# Altium schematic sheet Switches.SchDoc
size A4
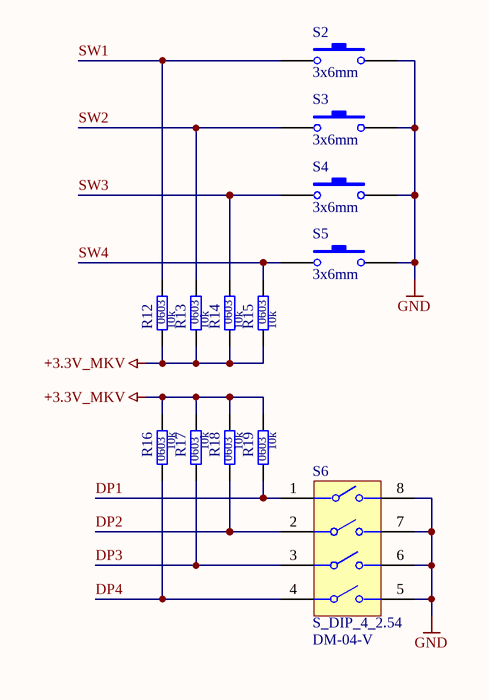
[diagram p0: Switches.SchDoc]

## Parts
R12  value 10k  SCH_Footprint: 0603  [R_0603_1608]  (hidden comment: Resistor)
R13  value 10k  SCH_Footprint: 0603  [R_0603_1608]  (hidden comment: Resistor)
R14  value 10k  SCH_Footprint: 0603  [R_0603_1608]  (hidden comment: Resistor)
R15  value 10k  SCH_Footprint: 0603  [R_0603_1608]  (hidden comment: Resistor)
R16  value 10k  SCH_Footprint: 0603  [R_0603_1608]  (hidden comment: Resistor)
R17  value 10k  SCH_Footprint: 0603  [R_0603_1608]  (hidden comment: Resistor)
R18  value 10k  SCH_Footprint: 0603  [R_0603_1608]  (hidden comment: Resistor)
R19  value 10k  SCH_Footprint: 0603  [R_0603_1608]  (hidden comment: Resistor)
S2  3x6mm  [S_TACTSWITCH3x6]
S3  3x6mm  [S_TACTSWITCH3x6]
S4  3x6mm  [S_TACTSWITCH3x6]
S5  3x6mm  [S_TACTSWITCH3x6]
S6  value DM-04-V  [S_DIP_4_2.54]  (hidden comment: DIP SWITCH 4 POS)

## Nets
+3.3V_MKV: R12.1 R13.1 R14.1 R15.1 R16.1 R17.1 R18.1 R19.1
GND: S2.2 S3.2 S4.2 S5.2 S6.5 S6.6 S6.7 S6.8
DP1: R19.2 S6.1
DP2: R18.2 S6.2
DP3: R17.2 S6.3
DP4: R16.2 S6.4
SW1: R12.2 S2.1
SW2: R13.2 S3.1
SW3: R14.2 S4.1
SW4: R15.2 S5.1

## Library data of the parts
R12-R19 = R_10k_0603_1: Manufacturer: Vishay; Manufacturer Part Number: CRCW060310K0FKTABC; Voltage: 75V; Power: 100mW; Tolerance: 1%; Part Number: R_10k_0603_1; HelpURL: http://www.tme.eu/pl/Document/622e28308c06d160637f2b14751ba16b/Data%20Sheet%20CRCW_BCe3.pdf; Supplier 1: TME; Supplier Part Number 1: CRCW060310K0FKTABC; Supplier 2: RS Components; Supplier 3: Farnell; Supplier 4: Mouser; Supplier Part Number 4: 667-ERJ-3EKF1002V; Supplier 5: Digi-Key; Supplier Part Number 5: P10KGCT-ND
S2-S5 = S_TACTSWITCH: Tact Switch; Manufacturer: Ninigi; Manufacturer Part Number: TACTM-34N-F; Part Number: S_TACTSWITCH; SCH_Footprint: 3x6mm; HelpURL: http://pl.ninigi.com/product/tactm-34n-f/pdf; Supplier 1: TME; Supplier Part Number 1: TACTM-34N-F; Supplier 2: RS Components; Supplier 3: Farnell; Supplier 4: Mouser; Supplier 5: Digi-Key
S6 = S_DM-04-V: Manufacturer: DIPTRONICS; Part Number: S_DM-04-V; SCH_Footprint: S_DIP_4_2.54; HelpURL: https://www.tme.eu/pl/Document/3859235cbbc3386afa52bad431a134f4/DM-SERIES.pdf; Manufacturer Part Number: DM-04-V; Supplier 1: TME; Supplier Part Number 1: ESD104E; Supplier 2: RS Components; Supplier 3: Farnell; Supplier 4: Mouser; Supplier Part Number 4: 113-DM04VTR; Supplier 5: Digi-Key